# EAGLE design schema_4 (EAGLE 9.0.0)
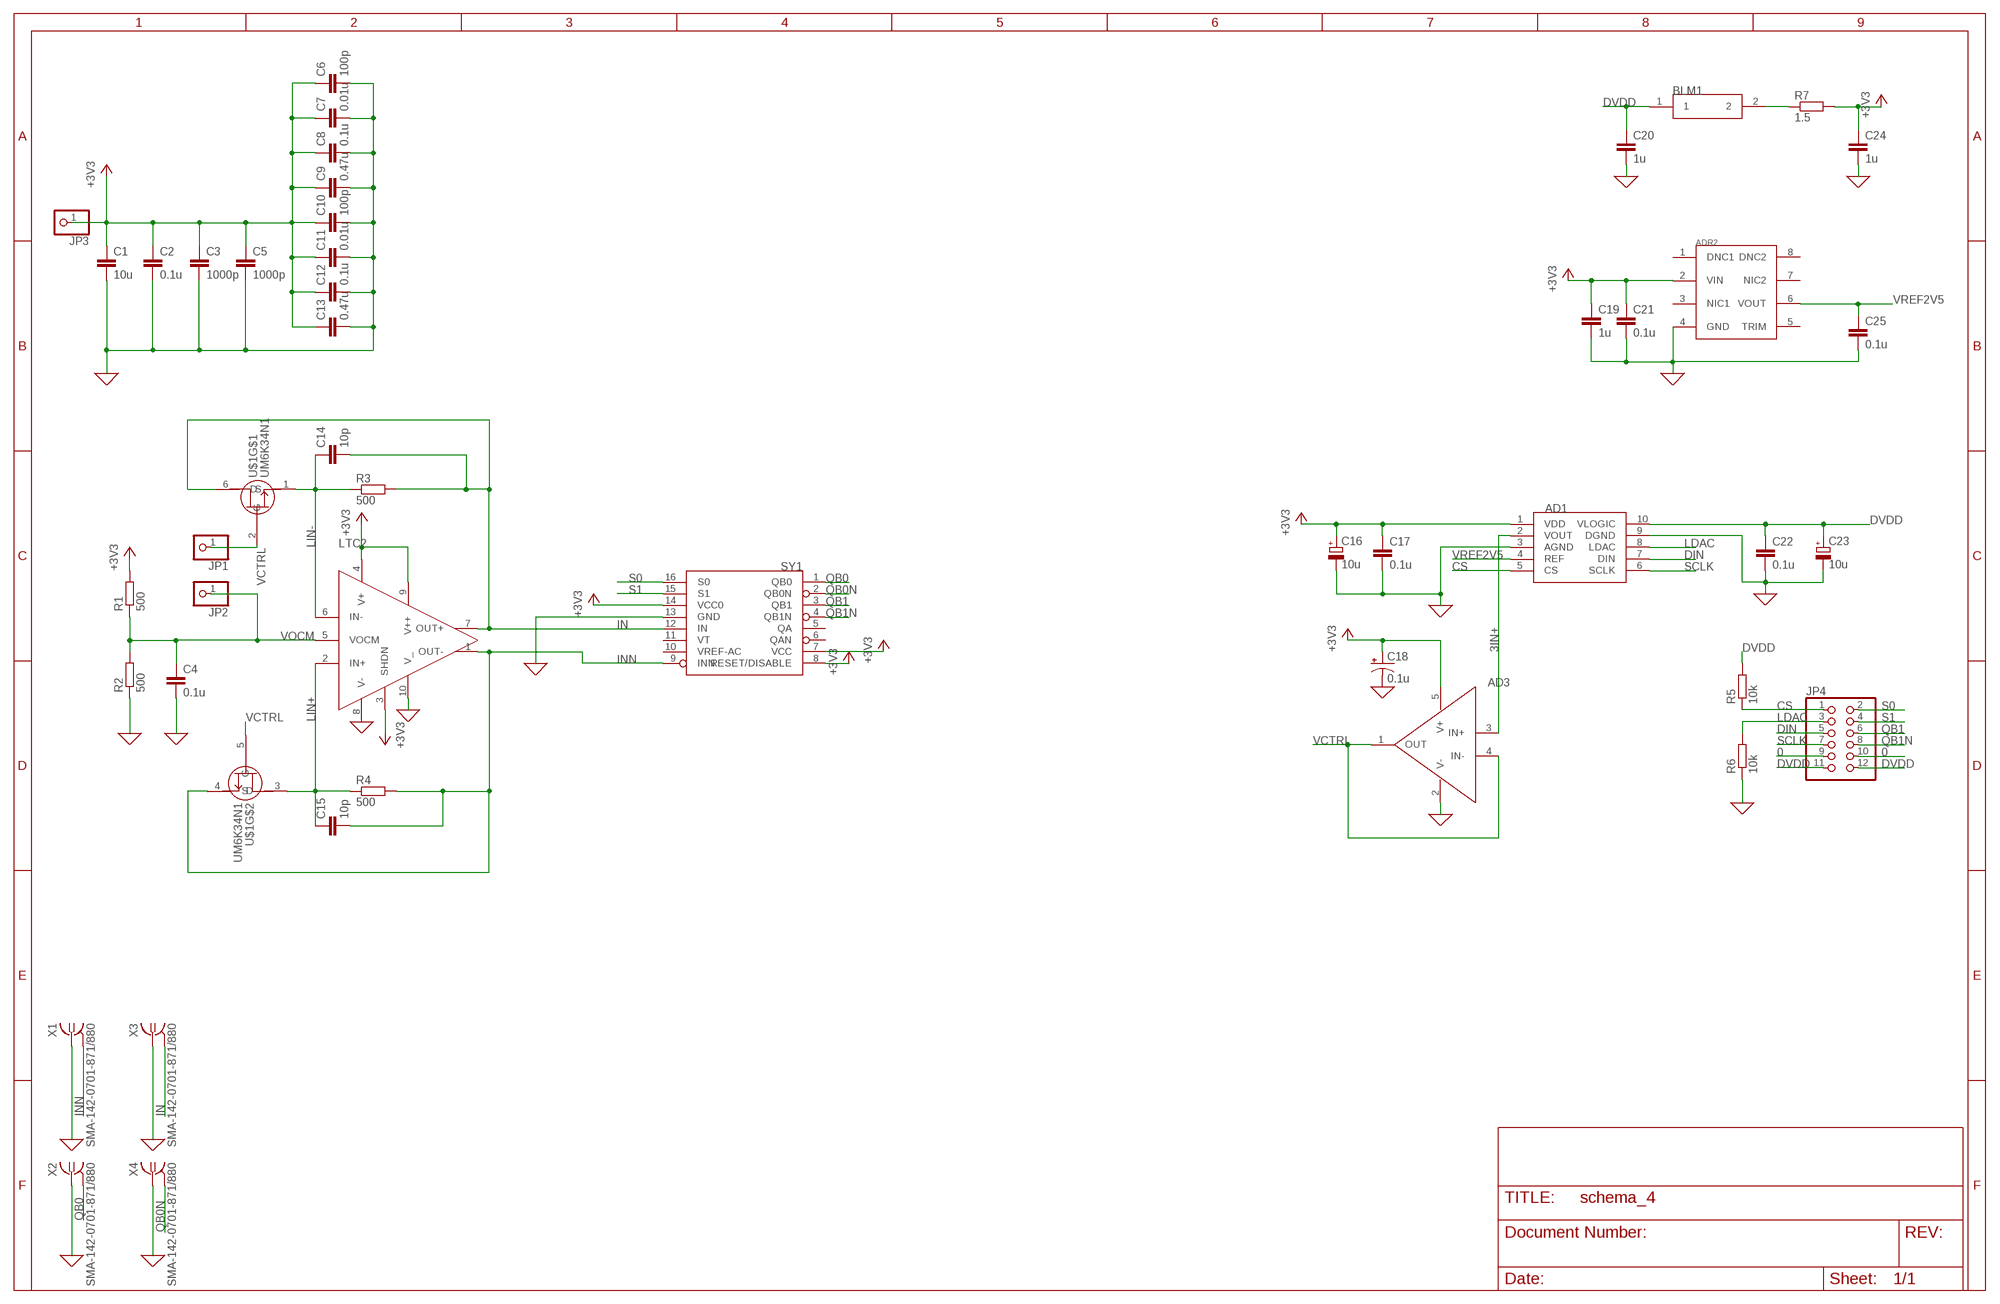
[diagram p0: schematic, sheet 1]

## Parts
AD1  0  AD5541AN  [SOP50P490X110-10]
AD3  0  AD8605N  [SOT95P280X145-5]
ADR2  ADR441N  [SOIC127P600X175-8]
BLM1  0  BLM18EG221TN1D  [C1608]
C1  10u  C-EUC1210  [C1210]
C2  0.1u  C-EUC0603  [C0603]
C3  1000p  C-EUC1206  [C1206]
C4  0.1u  C-EUC0603  [C0603]
C5  1000p  C-EUC1206  [C1206]
C6  100p  C-EUC0805  [C0805]
C7  0.01u  C-EUC1808  [C1808]
C8  0.1u  C-EUC0603  [C0603]
C9  0.47u  C-EUC1210  [C1210]
C10  100p  C-EUC0805  [C0805]
C11  0.01u  C-EUC1808  [C1808]
C12  0.1u  C-EUC0603  [C0603]
C13  0.47u  C-EUC1210  [C1210]
C14  10p  C-EUC1206  [C1206]
C15  10p  C-EUC1206  [C1206]
C16  10u  CPOL-EU153CLV-0405  [153CLV-0405]
C17  0.1u  C-EUC0603  [C0603]
C18  0.1u  CPOL-US153CLV-0405  [153CLV-0405]
C19  1u  C-EUC0603  [C0603]
C20  1u  C-EUC0603  [C0603]
C21  0.1u  C-EUC0603  [C0603]
C22  0.1u  C-EUC0603  [C0603]
C23  10u  CPOL-EU153CLV-0405  [153CLV-0405]
C24  1u  C-EUC0603  [C0603]
C25  0.1u  C-EUC0603  [C0603]
JP1  0  PINHD-1X1  [1X01]
JP2  0  PINHD-1X1  [1X01]
JP3  0  PINHD-1X1  [1X01]
JP4  0  PINHD-2X6/90  [2X06/90]
LTC2  0  LTC6409N  [QFN50P350X250X80-10]
R1  500  R-EU_R0603  [R0603]
R2  500  R-EU_R0603  [R0603]
R3  500  R-EU_R0603  [R0603]
R4  500  R-EU_R0603  [R0603]
R5  10k  R-EU_R0805  [R0805]
R6  10k  R-EU_R0805  [R0805]
R7  1.5  R-EU_R0805  [R0805]
SY1  SY89873LN  [QFN50P300X300X90-16]
U$1  UM6K34N1  [SOTFL65P210X100-6]
X1  SMA-142-0701-871/880  [SMA-142-0701-871]
X2  SMA-142-0701-871/880  [SMA-142-0701-871]
X3  SMA-142-0701-871/880  [SMA-142-0701-871]
X4  SMA-142-0701-871/880  [SMA-142-0701-871]

## Nets
0: AD1.3(AGND) AD1.9(DGND) AD3.2(V-) ADR2.4(GND) C1.2 C2.2 C3.2 C4.2 C5.2 C6.2 C7.2 C8.2 C9.2 C10.2 C11.2 C12.2 C13.2 C16.- C17.2 C18.- C19.2 C20.2 C21.2 C22.2 C23.- C24.2 C25.2 JP4.9 JP4.10 LTC2.8(V-) LTC2.10(V_) R2.1 R6.1 SY1.13(GND) X1.1 X2.1 X3.1 X4.1 ; supply symbol labelled GND
3IN+: AD1.2(VOUT) AD3.3(IN+)
+3V3: AD1.1(VDD) AD3.5(V+) ADR2.2(VIN) C1.1 C2.1 C3.1 C5.1 C6.1 C7.1 C8.1 C9.1 C10.1 C11.1 C12.1 C13.1 C16.+ C17.1 C18.+ C19.1 C21.1 C24.1 JP3.1 LTC2.3(SHDN) LTC2.4(V+) LTC2.9(V++) R1.2 R7.2 SY1.7(VCC) SY1.8(RESET/DISABLE) SY1.14(VCC0)
CS: AD1.5(CS) JP4.1 R5.1
DIN: AD1.7(DIN) JP4.5
DVDD: AD1.10(VLOGIC) BLM1.1 C20.1 C22.1 C23.+ JP4.11 JP4.12 R5.2
IN: C14.2 LTC2.7(OUT+) R3.2 SY1.12(IN) U$1.6(D) X3.2@1 X3.2@2 X3.2@3 X3.2@4
INN: C15.2 LTC2.1(OUT-) R4.2 SY1.9(INN) U$1.4(S) X1.2@1 X1.2@2 X1.2@3 X1.2@4
LDAC: AD1.8(LDAC) JP4.3 R6.2
LIN+: C15.1 LTC2.2(IN+) R4.1 U$1.3(D)
LIN-: C14.1 LTC2.6(IN-) R3.1 U$1.1(S)
N$7: BLM1.2 R7.1
QB0: SY1.1(QB0) X2.2@1 X2.2@2 X2.2@3 X2.2@4
QB0N: SY1.2(QB0N) X4.2@1 X4.2@2 X4.2@3 X4.2@4
QB1: JP4.6 SY1.3(QB1)
QB1N: JP4.8 SY1.4(QB1N)
S0: JP4.2 SY1.16(S0)
S1: JP4.4 SY1.15(S1)
SCLK: AD1.6(SCLK) JP4.7
VCTRL: AD3.1(OUT) AD3.4(IN-) JP1.1 U$1.2(G) U$1.5(G)
VOCM: C4.1 JP2.1 LTC2.5(VOCM) R1.1 R2.2
VREF2V5: AD1.4(REF) ADR2.6(VOUT) C25.1
Unconnected: ADR2.1(DNC1) ADR2.3(NIC1) ADR2.5(TRIM) ADR2.7(NIC2) ADR2.8(DNC2) SY1.5(QA) SY1.6(QAN) SY1.10(VREF-AC) SY1.11(VT)

## Library data of the parts
AD1 = mylibrary:AD5541A
AD3 = mylibrary:AD8605
ADR2 = mylibrary:ADR441
BLM1 = mylibrary:BLM18EG221TN1D: https://www.tme.eu/en/details/blm18eg221tn1d/ferrite-beads/murata/
C1-C3 C5-C13 = rcl:C-EU: CAPACITOR, European symbol
C4 C14 C15 C17 C19-C22 C24 C25 = rcl:C-EU: CAPACITOR, European symbol; SPICEPREFIX: C
C16 C23 = resistor:CPOL-EU: POLARIZED CAPACITOR, European symbol
C18 = rcl:CPOL-US: POLARIZED CAPACITOR, American symbol; SPICEPREFIX: C
JP1-JP3 = pinhead:PINHD-1X1: PIN HEADER
JP4 = pinhead:PINHD-2X6: PIN HEADER
LTC2 = mylibrary:LTC6409
R1 R2 R5-R7 = rcl:R-EU_: RESISTOR, European symbol; SPICEPREFIX: R
R3 R4 = resistor:R-EU_: RESISTOR, European symbol
SY1 = mylibrary:SY89873L
U$1 = mylibrary:UM6K34N1
X1-X4 = con-coax:SMA-: SMA 50 Ohm End Launch Jack Receptacle - Round Contact Johnson Components Source: www.johnsoncomponents.com .. J502-ND.pdf; MF: JOHNSON COMPONENTS; MPN: 142-0701-871; OC_FARNELL: 1339835; OC_NEWARK: 91B6105

## Board
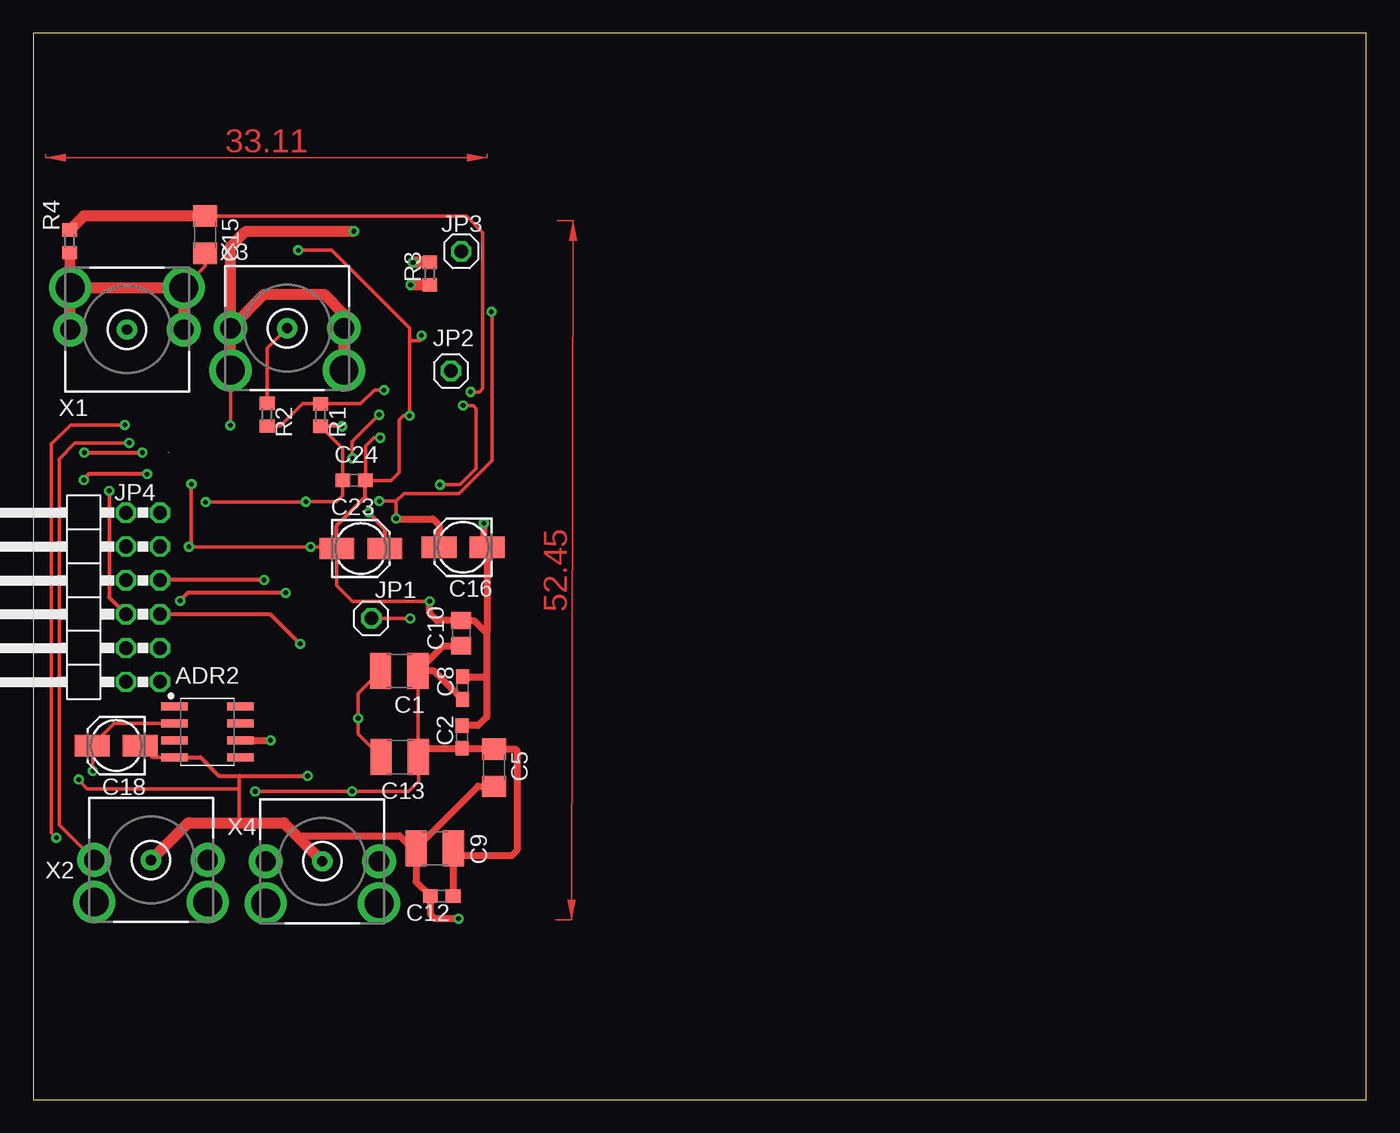
[diagram p1: board, top side]
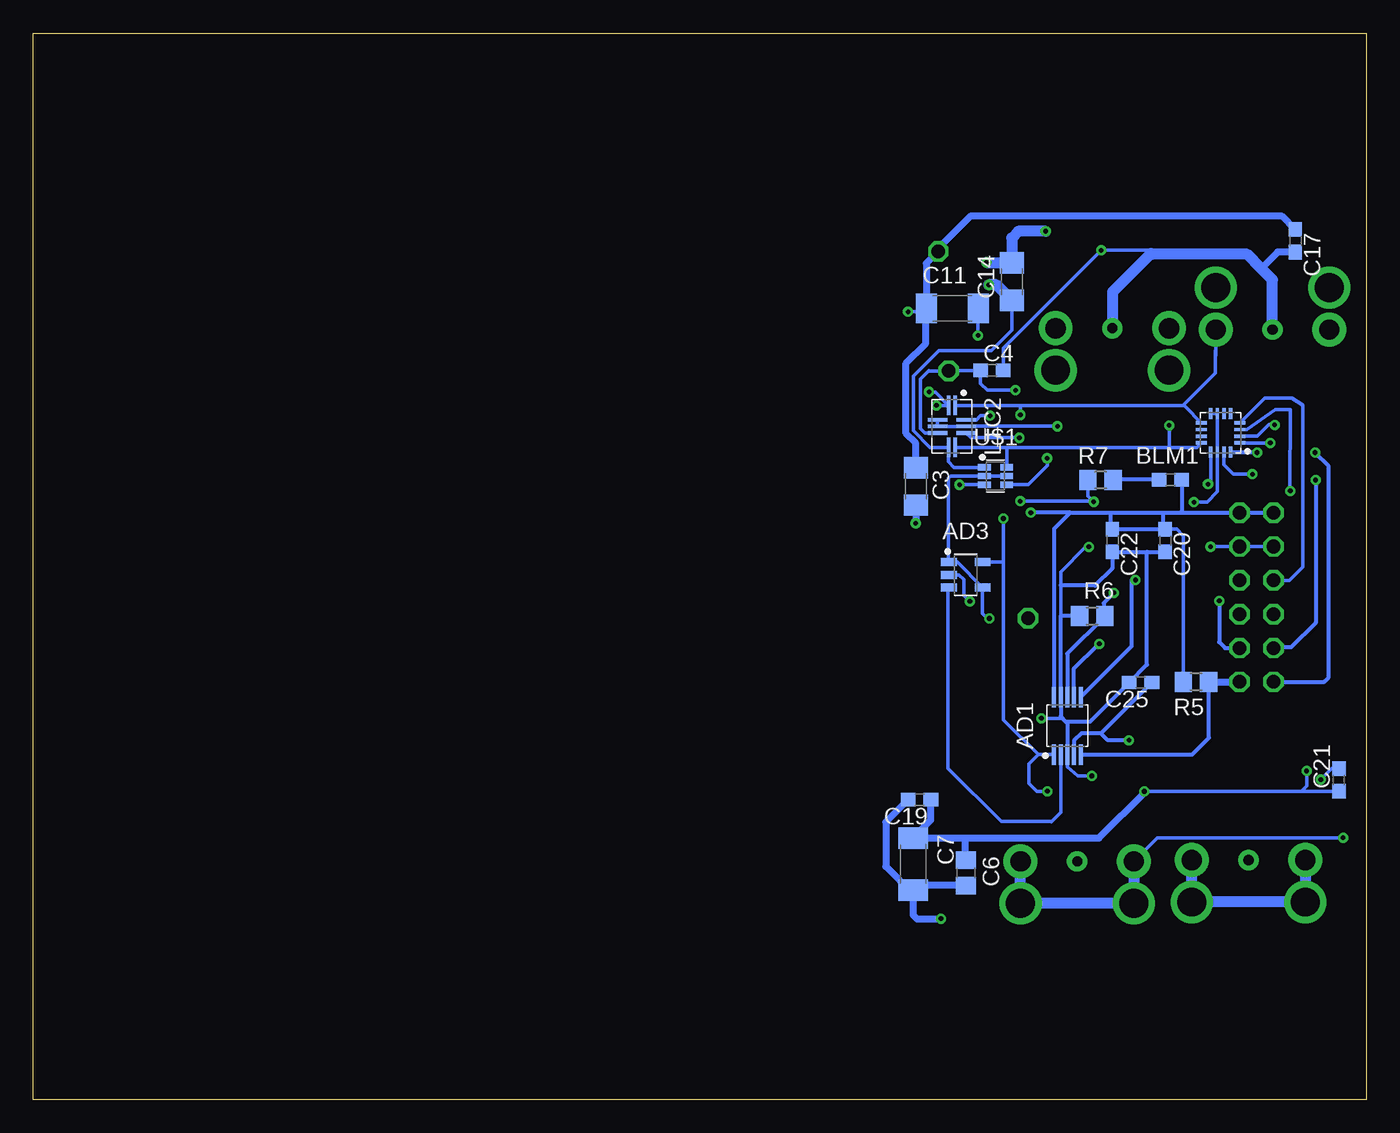
[diagram p2: board, bottom side, seen from below]

Size 100 x 80 mm. Coordinates in mm from the lower left corner, seen from the top.
Outline: 0,0 100,0 100,80 0,80 0,0
Copper layers (1*16): Top 0.035mm / dielectric 1.5mm / Bottom 0.035mm
Design rules "default": minimum track width 6mil, minimum drill 0.35mm, track to track 6mil, track to pad 6mil, pad to pad 6mil, via to via 6mil, smd to smd 6mil, copper to edge 40mil, drill to drill 6mil, minimum pad ring 10mil, minimum via ring 8mil, stop-mask expansion 4mil, vias tented up to drill 0mil, thermal gap 10mil

### Footprints (pad centres in the part's own frame; a part is rotated, then mirrored left to right if it is on the bottom)
SOP50P490X110-10 = smd 1.55 x 0.297: 1 -2.156,1; 2 -2.156,0.5; 3 -2.156,0; 4 -2.156,-0.5; 5 -2.156,-1; 6 2.156,-1; 7 2.156,-0.5; 8 2.156,0; 9 2.156,0.5; 10 2.156,1
SOT95P280X145-5 = smd 1.186 x 0.597: 1 -1.264,0.95; 2 -1.264,0; 3 -1.264,-0.95; 4 1.264,-0.95; 5 1.264,0.95
SOIC127P600X175-8 = smd 1.968 x 0.599: 1 -2.473,1.905; 2 -2.473,0.635; 3 -2.473,-0.635; 4 -2.473,-1.905; 5 2.473,-1.905; 6 2.473,-0.635; 7 2.473,0.635; 8 2.473,1.905
C1608 = smd 1.1 x 1: 1 -0.85,0; 2 0.85,0
C1210 = smd 1.6 x 2.7: 1 -1.4,0; 2 1.4,0
C0603 = smd 1.1 x 1: 1 -0.85,0; 2 0.85,0
C1206 = smd 1.6 x 1.8: 1 -1.4,0; 2 1.4,0
C0805 = smd 1.3 x 1.5: 1 -0.95,0; 2 0.95,0
C1808 = smd 1.6 x 2.2: 1 -1.95,0; 2 1.95,0
153CLV-0405 = smd 2.6 x 1.6: + 1.8,0; - -1.8,0
1X01 = drill 1.016 octagon: 1 0,0
2X06/90 = drill 1.016 octagon: 1 -6.35,-6.35; 2 -6.35,-3.81; 3 -3.81,-6.35; 4 -3.81,-3.81; 5 -1.27,-6.35; 6 -1.27,-3.81; 7 1.27,-6.35; 8 1.27,-3.81; 9 3.81,-6.35; 10 3.81,-3.81; 11 6.35,-6.35; 12 6.35,-3.81
QFN50P350X250X80-10 = smd 1.459 x 0.27: 1 -1.574,0.25; 2 -1.574,-0.25; 6 1.574,-0.25; 7 1.574,0.25 | smd 0.27 x 1.459: 3 -0.5,-1.074; 4 0,-1.074; 5 0.5,-1.074; 8 0.5,1.074; 9 0,1.074; 10 -0.5,1.074
R0603 = smd 1 x 1.1: 1 -0.85,0; 2 0.85,0
R0805 = smd 1.3 x 1.5: 1 -0.95,0; 2 0.95,0
QFN50P300X300X90-16 = smd 0.81 x 0.25: 1 -1.445,0.75; 2 -1.445,0.25; 3 -1.445,-0.25; 4 -1.445,-0.75; 9 1.445,-0.75; 10 1.445,-0.25; 11 1.445,0.25; 12 1.445,0.75 | smd 0.25 x 0.81: 5 -0.75,-1.445; 6 -0.25,-1.445; 7 0.25,-1.445; 8 0.75,-1.445; 13 0.75,1.445; 14 0.25,1.445; 15 -0.25,1.445; 16 -0.75,1.445
SOTFL65P210X100-6 = smd 0.956 x 0.472: 1 -0.836,0.65; 2 -0.836,0; 3 -0.836,-0.65; 4 0.836,-0.65; 5 0.836,0; 6 0.836,0.65
SMA-142-0701-871 = drill 0.762 pad 1.524: 1 0,0 | drill 1.524 pad 2.54: 2@1 -4.255,0; 2@2 4.255,0 | drill 2.159 pad 2.794: 2@3 -4.255,-3.15; 2@4 4.255,-3.15

### Placement (x,y rotation side)
AD1  22.42,28.04 90 bottom
AD3  30.04,39.37 0 bottom
ADR2  13.06,27.58 0 top
BLM1  14.69,46.5 180 bottom
C1  27.46,32.15 180 top
C2  32.17,27.2 90 top
C3  33.79,46 270 bottom
C4  28.08,54.72 0 bottom
C5  34.59,24.89 270 top
C6  30.03,17.01 270 bottom
C7  34,17.67 270 bottom
C8  32.21,30.87 90 top
C9  30.12,18.85 180 top
C10  32.11,34.99 90 top
C11  31.05,59.37 0 bottom
C12  30.64,15.27 180 top
C13  27.49,25.69 180 top
C14  26.6,61.37 90 bottom
C15  12.88,64.89 270 top
C16  32.24,41.44 180 top
C17  5.31,64.43 270 bottom
C18  6.22,26.56 180 top
C19  33.51,22.51 180 bottom
C20  15.08,41.94 270 bottom
C21  2.05,23.98 90 bottom
C22  19.04,41.95 270 bottom
C23  24.57,41.34 0 top
C24  24.07,46.46 0 top
C25  16.93,31.3 180 bottom
JP1  25.35,36.1 180 top
JP2  31.32,54.67 0 top
JP3  32.1,63.64 0 top
JP4  3.14,37.69 90 top
LTC2  31.09,50.51 270 bottom
R1  21.56,51.35 270 top
R2  17.54,51.38 270 top
R3  29.75,61.97 90 top
R4  2.73,64.4 270 top
R5  12.77,31.34 180 bottom
R6  20.56,36.27 0 bottom
R7  19.94,46.48 180 bottom
SY1  10.92,50.02 180 bottom
U$1  27.8,46.79 0 bottom
X1  7.03,57.77 180 top
X2  8.83,17.97 0 top
X3  19.04,57.87 0 top
X4  21.68,17.87 0 top

### Tracks (layer width: path | path; a pad name or v marks a point on that pad's centre or on a via)
0  (via drill 0.35)
  Top 0.254: 11.91,41.47 v20.81,41.47 22.64,41.47 C23.- 22.77,38.57 23.96,37.39 29.73,37.39 v29.74,37.38 | 11.91,41.47 11.68,41.47 | 11.68,41.47 v11.67,41.48 | 15.49,24.29 15.44,24.24 15.44,23.32 | 15.44,23.32 15.44,20.76 | C18.- 8.91,25.67 ADR2.4 | v26.02,49.65 25.55,49.65 24.92,49.02 C24.2 26.85,46.46 27.45,47.05 27.45,50.98 27.77,51.3 v28.21,51.3 v28.22,51.31 28.22,57.04 | 28.22,57.04 28.22,57.89 22.38,63.72 v19.88,63.72 | R2.1 17.54,56.37 X3.1 | 11.82,41.61 11.68,41.47 | v11.86,46.17 11.86,41.52 11.91,41.47 | C1.2 24.37,30.45 v24.37,28.6 24.37,27.42 C13.2 | 15.44,23.32 4.05,23.32 3.41,23.96 v3.41,24.01 | 28.22,57.04 28.32,56.93 29.01,56.93 29.12,57.04 v29.12,57.33
  Top 0.305: 20.86,41.46 v20.81,41.47 | C23.- 22.77,43.07 24.9,45.19 24.9,46.44 C24.2 | ADR2.4 12.55,25.67 13.92,24.29 15.49,24.29 20.45,24.29 | 20.45,24.29 | 20.45,24.29 20.58,24.29 v20.59,24.28
  Top 0.508: 19.75,19.8 27.48,19.8 28.43,18.85 C9.2 | C9.2 28.72,16.35 C12.2 29.79,13.94 29.78,13.93 30.14,13.57 v31.91,13.57 | v29.74,37.38 29.74,36.48 30.27,35.94 C10.2 33.06,35.94 34.01,34.99 | 34.01,34.99 34.01,31.76 | 34.01,31.76 34.01,28.7 33.36,28.05 C2.2 | C8.2 33.97,31.72 34.01,31.76 | 34.01,34.99 34.04,35.03 C16.- 33.8,41.69 v33.8,43.23 | C9.2 33.36,23.49 C5.2
  Top 0.813: X2.1 11.62,20.76 15.44,20.76 18.79,20.76 19.75,19.8 X4.1
  Bottom 0.254: JP4.10 JP4.9 11.65,41.49 v11.67,41.48 | 22.92,36.26 22.92,38.58 22.92,39.59 21.09,41.47 20.85,41.47 v20.81,41.47 | AD1.3 22.43,25.79 22.43,24.97 21.64,24.28 v20.59,24.28 | v26.02,49.65 29.66,49.65 LTC2.8 | v28.22,51.31 28.94,51.31 29.25,51 LTC2.10 | 16.14,63.48 16.38,63.72 v19.88,63.72 27.23,56.37 C4.2 | SY1.13 11.67,46.37 v11.86,46.17 | v11.86,46.17 | v29.74,37.38 30.18,37.82 30.18,39.02 30.54,39.37 AD3.2 | 22.77,28.6 24.34,28.6 24.37,28.63 v24.37,28.6 | v3.41,24.01 2.59,24.83 C21.2 | v29.12,57.33 29.12,59.35 C11.2
  Bottom 0.305: AD1.3 22.42,28.25 22.52,28.35 | 22.52,28.35 22.77,28.6 22.92,28.75 AD1.9 22.92,36.26 22.9,36.27 R6.1 | 16.44,41.09 C22.2 19.04,39.86 20.35,38.55 20.38,38.58 22.92,38.58 | 16.44,41.09 C20.2 | 22.52,28.35 20.73,28.35 C25.2 16.44,32.63 16.44,41.09
  Bottom 0.508: C17.2 6.64,63.58 7.87,62.36 | 34,15.45 C7.2 33.66,16.06 C6.2 | 34,15.45 34,13.84 33.7,13.55 31.92,13.55 v31.91,13.57 | C19.2 36.04,20.83 36.04,17.49 34,15.45 | C3.2 33.79,43.36 33.84,43.31 33.8,43.27 v33.8,43.23
  Bottom 0.813: X1.1 7.03,61.51 7.87,62.36 8.93,63.42 16.08,63.42 16.14,63.48 19.04,60.58 X3.1
3IN+
  Bottom 0.254: AD3.3 31.37,38.36 31.37,24.84 27.38,20.85 23.67,20.85 23.64,20.82 22.92,21.53 AD1.2
+3V3  (via drill 0.35)
  Top 0.254: v12.92,44.82 20.33,44.84 20.34,44.85 v20.44,44.85 22.74,44.85 23.21,45.33 C24.1 23.22,48.83 R1.2 | C18.+ 4.46,26.6 | 4.46,26.6 6.07,28.21 ADR2.2 | v16.65,23.12 16.66,23.11 16.68,23.13 v23.92,23.13 28.17,23.13 28.89,23.85 C13.1 28.86,25.72 C1.1 | v4.46,24.66 4.46,26.6 | R1.2 | R1.2 21.58,50.53 22.91,50.53 22.92,50.51 v23.16,50.51 | 27.23,44.9 26.04,44.9 v25.96,44.9 | 27.23,44.9 27.21,44.88 v27.21,43.59 | 27.23,44.9 27.8,45.47 31.94,45.47 34.41,47.94 34.41,59.09 34.39,59.11 v34.37,59.11
  Top 0.508: C10.1 30.75,34.04 C1.1 30.08,32.15 C8.1 | C13.1 29.55,26.35 31.91,26.35 | 31.91,26.35 C2.1 32.16,26.34 | C12.1 31.52,15.3 31.52,18.29 | 31.52,18.29 C9.1 | v27.21,43.59 27.24,43.57 29.98,43.57 30.44,43.1 C16.+ | 31.91,26.35 31.97,26.29 C5.1 36.17,26.29 36.29,26.18 36.29,18.7 35.88,18.29 31.52,18.29
  Bottom 0.254: SY1.8 SY1.7 SY1.14 11.17,45.61 11.93,44.84 12.48,44.84 v12.92,44.82 | R7.2 20.89,45.3 v20.44,44.85 20.49,44.9 v25.96,44.9 | 23.43,25.87 AD1.1 24.6,25.88 | v23.92,23.13 v23.93,23.13 24.71,23.13 25.29,23.71 25.29,25.19 24.6,25.88 | v16.65,23.12 16.54,23.12 5.18,23.12 | 5.18,23.12 4.87,23.12 4.45,23.55 4.45,24.64 v4.46,24.66 | LTC2.9 30.14,50.51 | 30.14,50.51 30.46,50.51 | 30.46,50.51 LTC2.4 LTC2.3 | 30.25,50.5 30.14,50.51 | v23.16,50.51 30.45,50.51 30.46,50.51 | v27.21,43.59 27.21,40.38 | 27.21,40.38 27.21,28.5 24.6,25.88 | AD3.5 27.27,40.32 27.21,40.38 | 5.18,23.12 5.18,23.13 C21.1 | v34.37,59.11 33.33,59.11 33.21,59.23 32.99,59.44
  Bottom 0.508: C11.1 32.99,59.44 32.99,62.74 JP3.1 32.1,63.87 29.7,66.27 6.3,66.27 C17.1 | 30.08,19.62 C7.1 32.66,20.96 C19.1 | 30.08,19.62 20.04,19.62 16.54,23.12 | C6.1 30.08,18.01 30.08,19.62 | C3.1 33.79,49.25 34.51,49.97 34.51,55.25 33.05,56.72 33.05,59.06 33.21,59.23
CS
  Bottom 0.305: AD1.5 13.05,25.88 11.79,27.14 11.82,27.18 R5.1
  Bottom 0.508: R5.1 JP4.1
DIN  (via drill 0.35)
  Top 0.305: JP4.5 9.52,36.39 17.82,36.39 v20.02,34.19
  Bottom 0.305: AD1.7 21.92,32.35 20.11,34.16 20.05,34.16 v20.02,34.19
DVDD  (via drill 0.35)
  Top 0.305: v25.16,44.04 26.37,42.79 C23.+
  Bottom 0.254: 13.27,44.01 13.27,44.03 | R5.2 13.72,42.3 14.21,42.79 C20.1
  Bottom 0.305: JP4.12 JP4.11 11.75,44.03 13.27,44.03 | AD1.10 23.42,42.79 22.18,44.03 | C20.1 C22.1 19.14,42.9 19.14,44.03 | C20.1 15.26,42.97 | 22.18,44.03 19.14,44.03 | 19.14,44.03 15.22,44.03 | 15.22,44.03 13.93,44.03 | 13.93,44.03 13.29,44.03 13.27,44.01 | C20.1 15.22,42.94 15.22,44.03 | BLM1.1 13.84,44.12 13.93,44.03 | 22.18,44.03 v25.15,44.03 | v25.15,44.03 25.17,44.01 | v25.15,44.03 25.14,44.04 v25.16,44.04
IN  (via drill 0.35)
  Top 0.254: X3.2@3 14.79,50.66 14.78,50.64 v14.78,50.59 v14.78,50.58
  Top 0.813: X3.2@1 17.34,60.42 21.81,60.42 23.3,58.93 X3.2@2 X3.2@4 | X3.2@3 X3.2@1 | X3.2@1 14.79,64 15.94,65.16 24,65.16 24.02,65.13 v24.05,65.16 | v24.05,65.16 | R3.2 28.69,62.82 28.51,62.82 v28.49,62.81
  Bottom 0.254: LTC2.7 26.97,48.94 | 26.97,48.94 14.75,48.94 | 14.75,48.94 12.7,48.94 SY1.12 | v14.78,50.58 14.78,48.97 14.75,48.94 | U$1.6 26.97,48.94 | 26.97,48.94
  Bottom 0.813: v24.05,65.16 26.09,65.16 26.6,64.65 26.6,62.82 | 26.6,62.82 C14.2 | v28.49,62.81 26.61,62.81 26.6,62.82
INN  (via drill 0.35)
  Top 0.254: C15.2 12.88,62.52 X1.2@3 | v23.94,48.11 23.94,49.37 25.95,51.38 v25.94,51.37
  Top 0.813: X1.2@2 X1.2@4 | X1.2@4 X1.2@3 X1.2@1 | R4.2 2.73,60.96 X1.2@4
  Bottom 0.254: LTC2.1 25.96,52.08 | 25.96,52.08 13.74,52.08 | 13.74,52.08 13.68,52.08 13.57,51.98 | 13.57,51.98 SY1.9 | 13.55,51.99 13.57,51.98 | 13.74,52.08 11.3,54.52 11.3,55.81 | 11.3,55.81 11.3,56.19 | U$1.4 25.33,46.13 23.91,47.56 23.91,48.08 v23.94,48.11 | v23.94,48.11 | v25.94,51.37 25.96,51.39 25.96,52.08 | X1.2@1 11.28,55.83 11.3,55.81
LDAC  (via drill 0.35)
  Top 0.305: v18.93,38.02 11.6,38.02 11.05,37.48 11.05,37.45 v11.02,37.41
  Bottom 0.305: R6.2 19.7,36.19 | 19.7,36.19 22.42,33.46 AD1.8 | 19.16,38.02 v18.93,38.02 19.7,37.25 19.7,36.19 | v11.02,37.41 11.02,34.32 10.58,33.87 JP4.3
LIN+  (via drill 0.35)
  Top 0.254: v32.25,52.08 33,52.08 33.22,51.86 33.22,47.33 32.03,46.14 30.68,46.14 30.66,46.13 v30.51,46.13 | v32.8,53.1 33.48,53.1 33.71,53.33 33.71,65.05 32.49,66.27 12.9,66.27 C15.1
  Top 0.813: C15.1 3.77,66.29 R4.1
  Bottom 0.254: 32.28,52.08 LTC2.2 32.34,53.08 32.78,53.08 v32.8,53.1 | 32.28,52.08 32.29,52.09 | 32.28,52.08 v32.25,52.08 | v30.51,46.13 28.65,46.13 U$1.3
LIN-  (via drill 0.35)
  Top 0.813: v28.31,61.13 R3.1
  Bottom 0.254: U$1.1 30.92,47.44 31.34,47.86 LTC2.6 32.73,48.94 33.98,50.19 33.98,54.29 32.07,56.2 28.13,56.2 26.6,57.73 C14.1
  Bottom 0.813: C14.1 27.76,61.13 v28.31,61.13
N$7
  Bottom 0.305: BLM1.2 18.96,46.5 R7.1
QB0  (via drill 0.35)
  Top 0.254: v7.2,49.27 3.11,49.24 1.93,48.06 1.93,20.62 X2.2@1
  Bottom 0.254: SY1.1 7.16,49.27 v7.2,49.27
  Bottom 0.813: X2.2@1 X2.2@3 X2.2@4 X2.2@2
QB0N  (via drill 0.35)
  Top 0.254: v6.87,50.62 2.8,50.62 1.36,49.18 1.36,20.02 v1.73,19.64
  Bottom 0.254: SY1.2 8.19,49.77 7.31,50.64 6.89,50.64 v6.87,50.62 | v1.73,19.64 15.66,19.64 X4.2@1
  Bottom 0.813: X4.2@1 X4.2@3 X4.2@4 X4.2@2
QB1  (via drill 0.35)
  Top 0.305: v5.69,45.67 5.69,37.68 JP4.6
  Bottom 0.254: v5.69,45.67 5.72,45.7 5.7,51.78 6.82,51.78 8.97,50.27 SY1.3
QB1N
  Bottom 0.254: JP4.8 5.76,38.95 4.76,39.95 4.76,52.12 4.77,52.12 5.58,52.63 7.61,52.63 SY1.4
S0  (via drill 0.35)  (1 unrouted)
  Top 0.305: v3.83,48.54 8.07,48.54 8.09,48.53 8.16,48.53 v8.18,48.55
  Bottom 0.305: JP4.2 3.16,31.34 2.82,31.68 2.82,47.53 3.81,48.52 | 3.81,48.52 | 3.81,48.52 v3.83,48.54 | v8.18,48.55 10.14,48.55
S1  (via drill 0.35)
  Top 0.305: v8.53,46.92 4.15,46.92 3.84,46.61 3.84,46.52 v3.79,46.48
  Bottom 0.254: v8.53,46.92 9.95,46.92 10.67,47.63 10.67,47.67 SY1.15
  Bottom 0.305: 8.56,46.94 v8.53,46.92 | v3.79,46.48 3.79,35.77 5.64,33.92 6.9,33.92 JP4.4
SCLK  (via drill 0.35)
  Top 0.305: JP4.7 9.53,38.99 9.54,38.98 v17.3,38.98
  Bottom 0.305: AD1.6 17.59,34.02 17.59,38.95 17.34,38.95 v17.3,38.98
VCTRL  (via drill 0.35)
  Top 0.254: v28.27,36.09 25.37,36.09 JP1.1
  Bottom 0.254: U$1.5 U$1.2 30.23,46.78 30.23,46.79 31.17,46.79 31.33,46.62 31.33,40.35 AD3.1 30.68,40.32 AD3.4 28.78,36.47 28.41,36.1 28.28,36.1 v28.27,36.09
VOCM  (via drill 0.35)
  Top 0.254: R2.2 18.52,50.53 20.2,52.2 R1.1 24.57,52.2 25.59,53.22 v26.31,53.22
  Bottom 0.254: 28.95,54.7 30.83,54.7 30.87,54.67 JP2.1 32.75,54.67 32.79,54.71 33.46,54.04 33.46,50.35 33.12,50.01 LTC2.5 | 28.95,54.7 C4.1 | v26.31,53.22 28.42,53.22 28.93,53.73 28.93,54.68 28.95,54.7
VREF2V5  (via drill 0.35)
  Top 0.508: ADR2.6 17.56,26.94 v17.79,26.94 v17.8,26.95
  Bottom 0.305: C25.1 19.89,27.48 | 19.89,27.48 21.36,27.48 21.92,26.93 AD1.4 | v17.8,26.95 19.36,26.95 19.89,27.48
(copper drawn outside any net)
  shapes: Top area x2